# Altium schematic sheet lockdriver(BD682).SchDoc
size A2
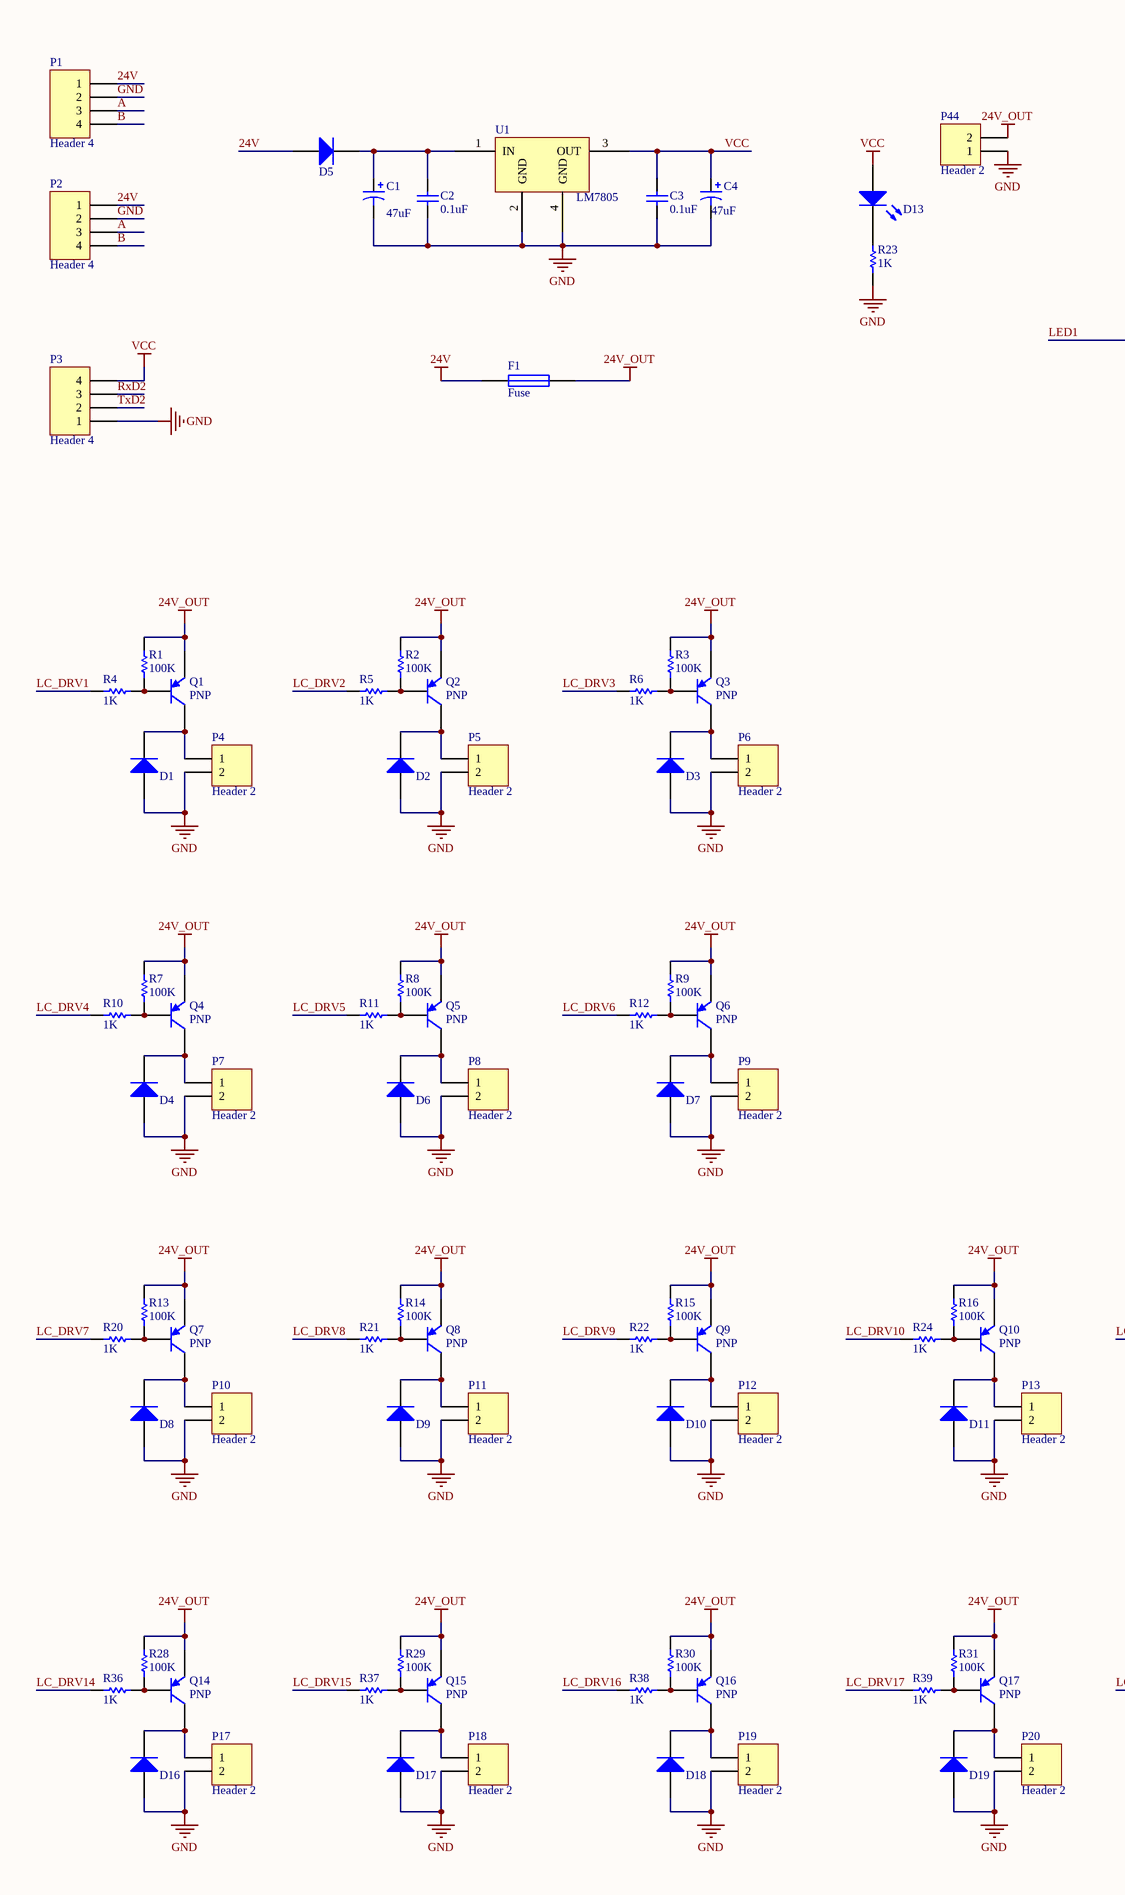
[diagram p0: lockdriver(BD682).SchDoc, left]
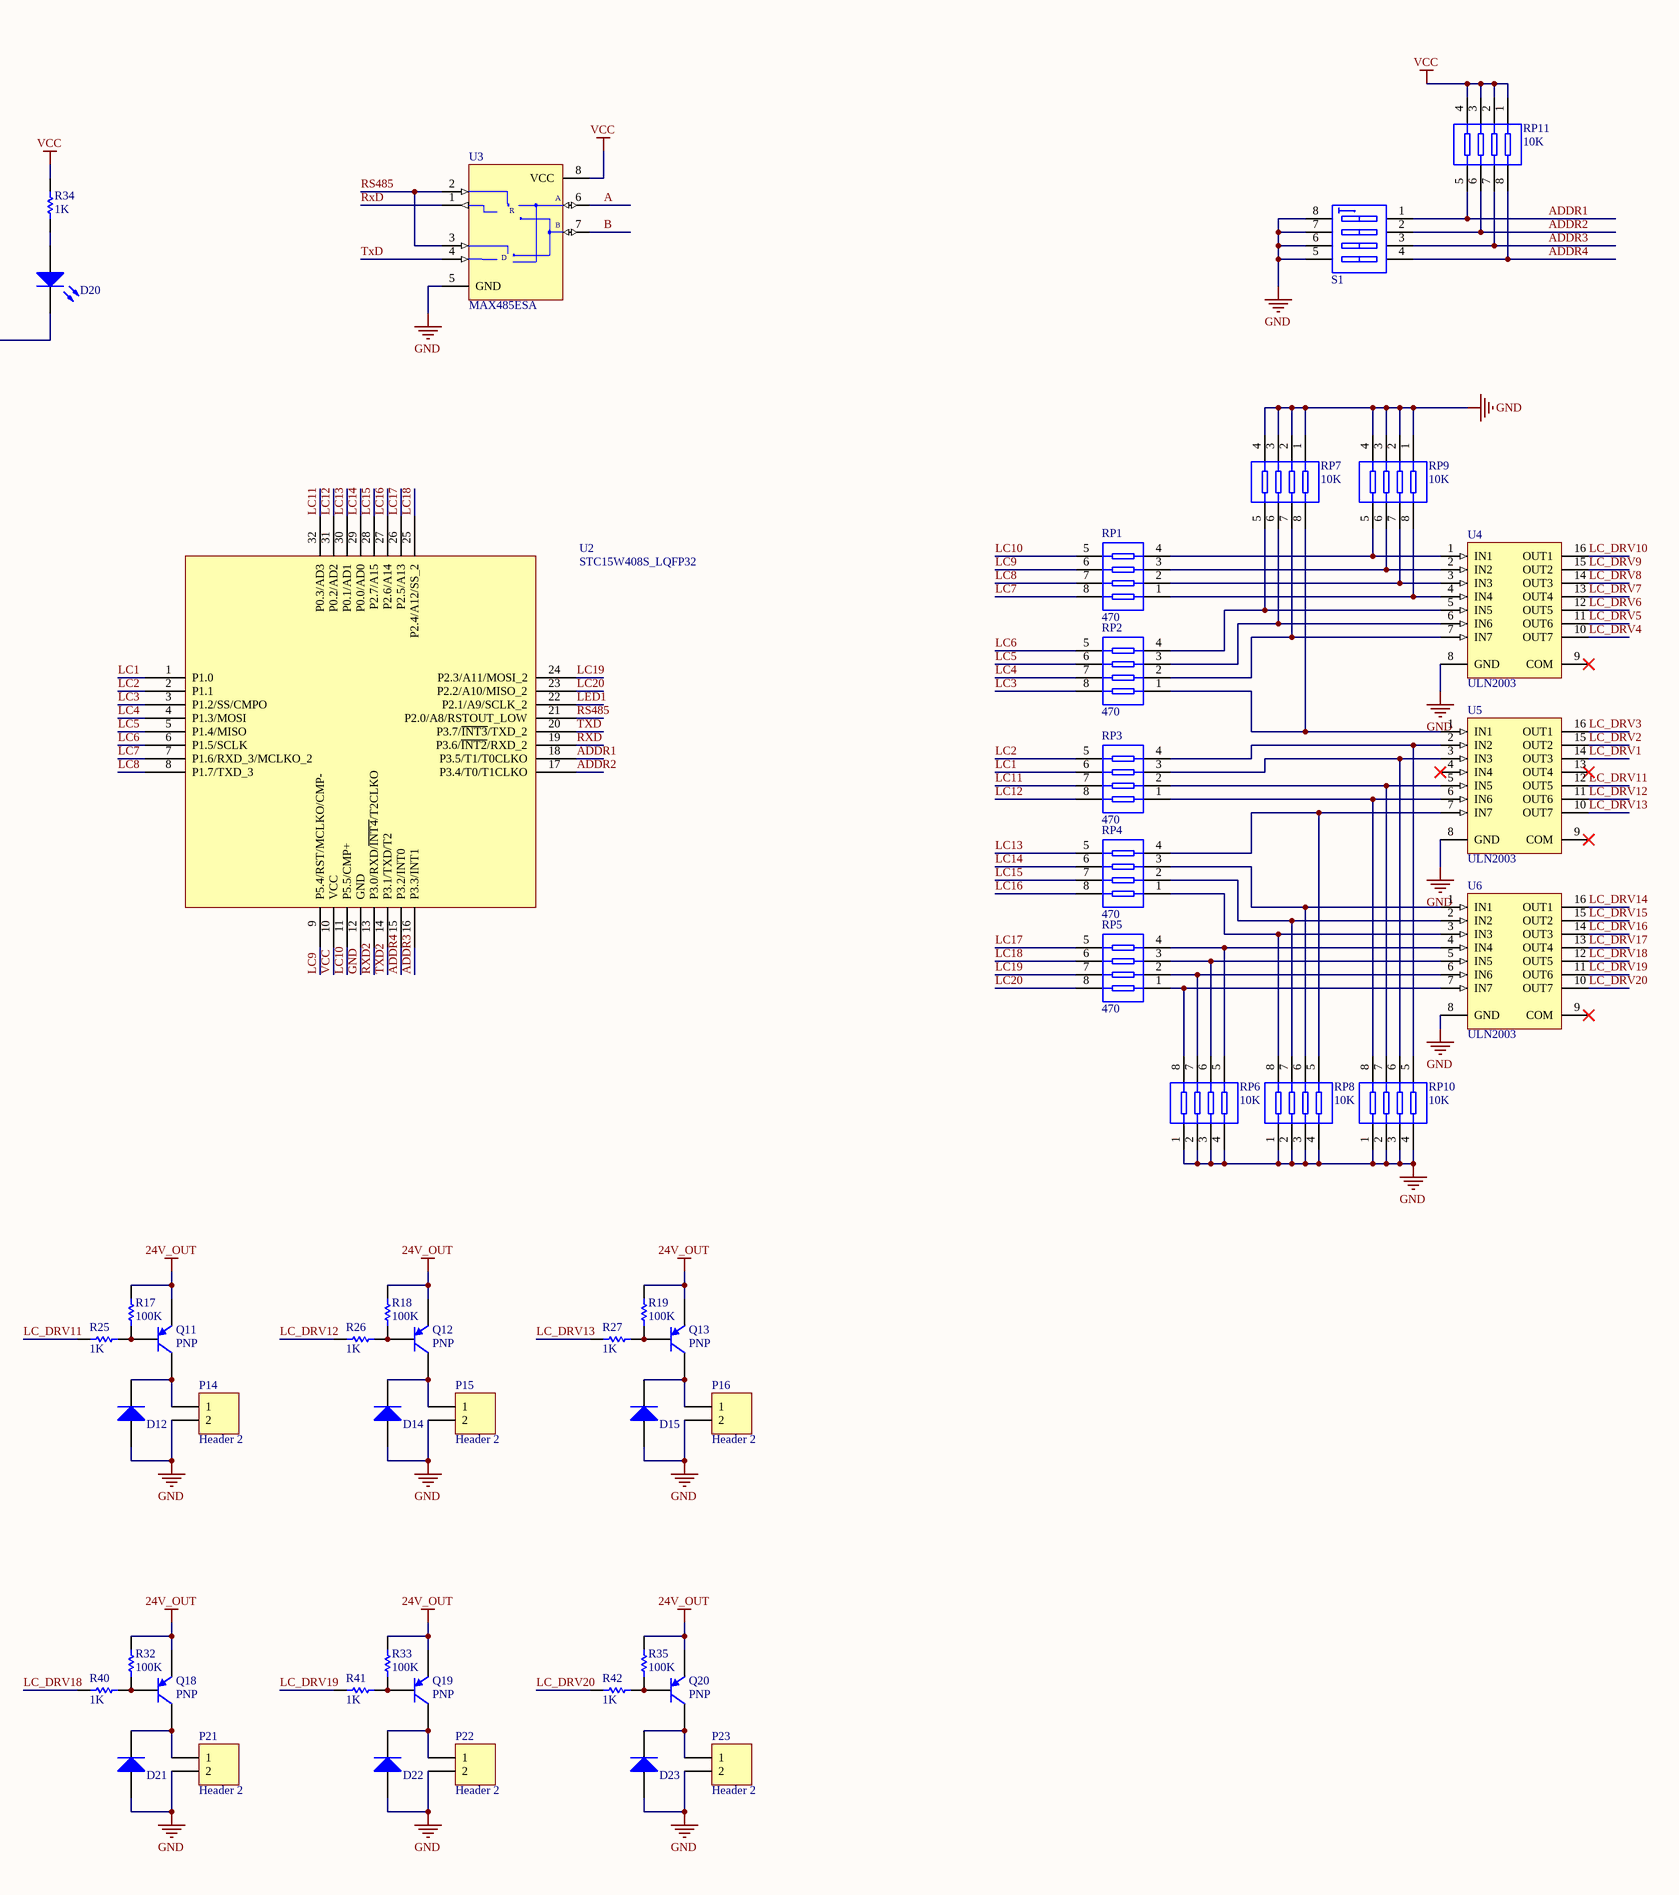
[diagram p1: lockdriver(BD682).SchDoc, right]

## Parts
C1  value 47uF  [CAPPR2-5x11.5]  (hidden comment: Cap Pol2)
C2  0.1uF  [CAPC2012M]
C3  0.1uF  [CAPC2012M]
C4  value 47uF  [CAPPR2-5x11.5]  (hidden comment: Cap Pol2)
D1  1N4007  [DSO-C2/X1.8]  (value not drawn)
D2  1N4007  [DSO-C2/X1.8]  (value not drawn)
D3  1N4007  [DSO-C2/X1.8]  (value not drawn)
D4  1N4007  [DSO-C2/X1.8]  (value not drawn)
D5  1N4007  [DSO-C2/X1.8]  (value not drawn)
D6  1N4007  [DSO-C2/X1.8]  (value not drawn)
D7  1N4007  [DSO-C2/X1.8]  (value not drawn)
D8  1N4007  [DSO-C2/X1.8]  (value not drawn)
D9  1N4007  [DSO-C2/X1.8]  (value not drawn)
D10  1N4007  [DSO-C2/X1.8]  (value not drawn)
D11  1N4007  [DSO-C2/X1.8]  (value not drawn)
D12  1N4007  [DSO-C2/X1.8]  (value not drawn)
D13  LED  [LED2012M]  (value not drawn)
D14  1N4007  [DSO-C2/X1.8]  (value not drawn)
D15  1N4007  [DSO-C2/X1.8]  (value not drawn)
D16  1N4007  [DSO-C2/X1.8]  (value not drawn)
D17  1N4007  [DSO-C2/X1.8]  (value not drawn)
D18  1N4007  [DSO-C2/X1.8]  (value not drawn)
D19  1N4007  [DSO-C2/X1.8]  (value not drawn)
D20  LED  [LED2012M]  (value not drawn)
D21  1N4007  [DSO-C2/X1.8]  (value not drawn)
D22  1N4007  [DSO-C2/X1.8]  (value not drawn)
D23  1N4007  [DSO-C2/X1.8]  (value not drawn)
F1  Fuse  [SR075]
P1  Header 4  [VH396-4]
P2  Header 4  [VH396-4]
P3  Header 4  [HDR1X4]
P4  Header 2  [XH254-2]
P5  Header 2  [XH254-2]
P6  Header 2  [XH254-2]
P7  Header 2  [XH254-2]
P8  Header 2  [XH254-2]
P9  Header 2  [XH254-2]
P10  Header 2  [XH254-2]
P11  Header 2  [XH254-2]
P12  Header 2  [XH254-2]
P13  Header 2  [XH254-2]
P14  Header 2  [XH254-2]
P15  Header 2  [XH254-2]
P16  Header 2  [XH254-2]
P17  Header 2  [XH254-2]
P18  Header 2  [XH254-2]
P19  Header 2  [XH254-2]
P20  Header 2  [XH254-2]
P21  Header 2  [XH254-2]
P22  Header 2  [XH254-2]
P23  Header 2  [XH254-2]
P44  Header 2  [VH396-2]
Q1  PNP  [SOT_32]
Q2  PNP  [SOT_32]
Q3  PNP  [SOT_32]
Q4  PNP  [SOT_32]
Q5  PNP  [SOT_32]
Q6  PNP  [SOT_32]
Q7  PNP  [SOT_32]
Q8  PNP  [SOT_32]
Q9  PNP  [SOT_32]
Q10  PNP  [SOT_32]
Q11  PNP  [SOT_32]
Q12  PNP  [SOT_32]
Q13  PNP  [SOT_32]
Q14  PNP  [SOT_32]
Q15  PNP  [SOT_32]
Q16  PNP  [SOT_32]
Q17  PNP  [SOT_32]
Q18  PNP  [SOT_32]
Q19  PNP  [SOT_32]
Q20  PNP  [SOT_32]
R1  100K  [RESC2012M]
R2  100K  [RESC2012M]
R3  100K  [RESC2012M]
R4  1K  [RESC2012M]
R5  1K  [RESC2012M]
R6  1K  [RESC2012M]
R7  100K  [RESC2012M]
R8  100K  [RESC2012M]
R9  100K  [RESC2012M]
R10  1K  [RESC2012M]
R11  1K  [RESC2012M]
R12  1K  [RESC2012M]
R13  100K  [RESC2012M]
R14  100K  [RESC2012M]
R15  100K  [RESC2012M]
R16  100K  [RESC2012M]
R17  100K  [RESC2012M]
R18  100K  [RESC2012M]
R19  100K  [RESC2012M]
R20  1K  [RESC2012M]
R21  1K  [RESC2012M]
R22  1K  [RESC2012M]
R23  1K  [RESC2012M]
R24  1K  [RESC2012M]
R25  1K  [RESC2012M]
R26  1K  [RESC2012M]
R27  1K  [RESC2012M]
R28  100K  [RESC2012M]
R29  100K  [RESC2012M]
R30  100K  [RESC2012M]
R31  100K  [RESC2012M]
R32  100K  [RESC2012M]
R33  100K  [RESC2012M]
R34  1K  [RESC2012M]
R35  100K  [RESC2012M]
R36  1K  [RESC2012M]
R37  1K  [RESC2012M]
R38  1K  [RESC2012M]
R39  1K  [RESC2012M]
R40  1K  [RESC2012M]
R41  1K  [RESC2012M]
R42  1K  [RESC2012M]
RP1  470  [EXB38V]
RP2  470  [EXB38V]
RP3  470  [EXB38V]
RP4  470  [EXB38V]
RP5  470  [EXB38V]
RP6  10K  [EXB38V]
RP7  10K  [EXB38V]
RP8  10K  [EXB38V]
RP9  10K  [EXB38V]
RP10  10K  [EXB38V]
RP11  10K  [EXB38V]
S1  SW DIP-4  [SWITCH-8]  (value not drawn)
U1  LM7805  [SOT223-4M]
U2  STC15W408S_LQFP32  [LQFP32]
U3  MAX485ESA  [SO8_M]
U4  ULN2003  [SO16_M]
U5  ULN2003  [SO16_M]
U6  ULN2003  [SO16_M]

## Nets
24V: D5.1(A) F1.1 P1.1 P2.1
24V_OUT: F1.2 P44.2 Q1.2(E) Q2.2(E) Q3.2(E) Q4.2(E) Q5.2(E) Q6.2(E) Q7.2(E) Q8.2(E) Q9.2(E) Q10.2(E) Q11.2(E) Q12.2(E) Q13.2(E) Q14.2(E) Q15.2(E) Q16.2(E) Q17.2(E) Q18.2(E) Q19.2(E) Q20.2(E) R1.2 R2.2 R3.2 R7.2 R8.2 R9.2 R13.2 R14.2 R15.2 R16.2 R17.2 R18.2 R19.2 R28.2 R29.2 R30.2 R31.2 R32.2 R33.2 R35.2
GND: C1.2 C2.1 C3.2 C4.2 D1.1(A) D2.1(A) D3.1(A) D4.1(A) D6.1(A) D7.1(A) D8.1(A) D9.1(A) D10.1(A) D11.1(A) D12.1(A) D14.1(A) D15.1(A) D16.1(A) D17.1(A) D18.1(A) D19.1(A) D21.1(A) D22.1(A) D23.1(A) P1.2 P2.2 P3.1 P4.2 P5.2 P6.2 P7.2 P8.2 P9.2 P10.2 P11.2 P12.2 P13.2 P14.2 P15.2 P16.2 P17.2 P18.2 P19.2 P20.2 P21.2 P22.2 P23.2 P44.1 R23.1 RP6.1 RP6.2 RP6.3 RP6.4 RP7.1 RP7.2 RP7.3 RP7.4 RP8.1 RP8.2 RP8.3 RP8.4 RP9.1 RP9.2 RP9.3 RP9.4 RP10.1 RP10.2 RP10.3 RP10.4 S1.5(B4) S1.6(B3) S1.7(B2) S1.8(B1) U1.2(GND) U1.4(GND) U2.12(GND) U3.5(GND) U4.8(GND) U5.8(GND) U6.8(GND)
VCC: C3.1 C4.1 D13.1(A) P3.4 R34.2 RP11.1 RP11.2 RP11.3 RP11.4 U1.3(OUT) U2.10(VCC) U3.8(VCC)
A: P1.3 P2.3 U3.6(A)
ADDR1: RP11.5 S1.1(A1) U2.18(P3.5/T1/T0CLKO)
ADDR2: RP11.6 S1.2(A2) U2.17(P3.4/T0/T1CLKO)
ADDR3: RP11.7 S1.3(A3) U2.16(P3.3/INT1)
ADDR4: RP11.8 S1.4(A4) U2.15(P3.2/INT0)
B: P1.4 P2.4 U3.7(B)
LC1: RP3.6 U2.1(P1.0)
LC2: RP3.5 U2.2(P1.1)
LC3: RP2.8 U2.3(P1.2/SS/CMPO)
LC4: RP2.7 U2.4(P1.3/MOSI)
LC5: RP2.6 U2.5(P1.4/MISO)
LC6: RP2.5 U2.6(P1.5/SCLK)
LC7: RP1.8 U2.7(P1.6/RXD_3/MCLKO_2)
LC8: RP1.7 U2.8(P1.7/TXD_3)
LC9: RP1.6 U2.9(P5.4/RST/MCLKO/CMP-)
LC10: RP1.5 U2.11(P5.5/CMP+)
LC11: RP3.7 U2.32(P0.3/AD3)
LC12: RP3.8 U2.31(P0.2/AD2)
LC13: RP4.5 U2.30(P0.1/AD1)
LC14: RP4.6 U2.29(P0.0/AD0)
LC15: RP4.7 U2.28(P2.7/A15)
LC16: RP4.8 U2.27(P2.6/A14)
LC17: RP5.5 U2.26(P2.5/A13)
LC18: RP5.6 U2.25(P2.4/A12/SS_2)
LC19: RP5.7 U2.24(P2.3/A11/MOSI_2)
LC20: RP5.8 U2.23(P2.2/A10/MISO_2)
LC_DRV1: R4.2 U5.14(OUT3)
LC_DRV2: R5.2 U5.15(OUT2)
LC_DRV3: R6.2 U5.16(OUT1)
LC_DRV4: R10.2 U4.10(OUT7)
LC_DRV5: R11.2 U4.11(OUT6)
LC_DRV6: R12.2 U4.12(OUT5)
LC_DRV7: R20.2 U4.13(OUT4)
LC_DRV8: R21.2 U4.14(OUT3)
LC_DRV9: R22.2 U4.15(OUT2)
LC_DRV10: R24.2 U4.16(OUT1)
LC_DRV11: R25.2 U5.12(OUT5)
LC_DRV12: R26.2 U5.11(OUT6)
LC_DRV13: R27.2 U5.10(OUT7)
LC_DRV14: R36.2 U6.16(OUT1)
LC_DRV15: R37.2 U6.15(OUT2)
LC_DRV16: R38.2 U6.14(OUT3)
LC_DRV17: R39.2 U6.13(OUT4)
LC_DRV18: R40.2 U6.12(OUT5)
LC_DRV19: R41.2 U6.11(OUT6)
LC_DRV20: R42.2 U6.10(OUT7)
LED1: D20.2(K) U2.22(P2.1/A9/SCLK_2)
RS485: U2.21(P2.0/A8/RSTOUT_LOW) U3.2(~{RE}) U3.3(DE)
RxD: U2.19(P3.6/~{INT2}/RXD_2) U3.1(RO)
RxD2: P3.3 U2.13(P3.0/RXD/~{INT4}/T2CLKO)
TxD: U2.20(P3.7/~{INT3}/TXD_2) U3.4(DI)
TxD2: P3.2 U2.14(P3.1/TXD/T2)
NetC1_1: C1.1 C2.2 D5.2(K) U1.1(IN)
NetD1_2: D1.2(K) P4.1 Q1.3(C)
NetD2_2: D2.2(K) P5.1 Q2.3(C)
NetD3_2: D3.2(K) P6.1 Q3.3(C)
NetD4_2: D4.2(K) P7.1 Q4.3(C)
NetD6_2: D6.2(K) P8.1 Q5.3(C)
NetD7_2: D7.2(K) P9.1 Q6.3(C)
NetD8_2: D8.2(K) P10.1 Q7.3(C)
NetD9_2: D9.2(K) P11.1 Q8.3(C)
NetD10_2: D10.2(K) P12.1 Q9.3(C)
NetD11_2: D11.2(K) P13.1 Q10.3(C)
NetD12_2: D12.2(K) P14.1 Q11.3(C)
NetD13_2: D13.2(K) R23.2
NetD14_2: D14.2(K) P15.1 Q12.3(C)
NetD15_2: D15.2(K) P16.1 Q13.3(C)
NetD16_2: D16.2(K) P17.1 Q14.3(C)
NetD17_2: D17.2(K) P18.1 Q15.3(C)
NetD18_2: D18.2(K) P19.1 Q16.3(C)
NetD19_2: D19.2(K) P20.1 Q17.3(C)
NetD20_1: D20.1(A) R34.1
NetD21_2: D21.2(K) P21.1 Q18.3(C)
NetD22_2: D22.2(K) P22.1 Q19.3(C)
NetD23_2: D23.2(K) P23.1 Q20.3(C)
NetQ1_1: Q1.1(B) R1.1 R4.1
NetQ2_1: Q2.1(B) R2.1 R5.1
NetQ3_1: Q3.1(B) R3.1 R6.1
NetQ4_1: Q4.1(B) R7.1 R10.1
NetQ5_1: Q5.1(B) R8.1 R11.1
NetQ6_1: Q6.1(B) R9.1 R12.1
NetQ7_1: Q7.1(B) R13.1 R20.1
NetQ8_1: Q8.1(B) R14.1 R21.1
NetQ9_1: Q9.1(B) R15.1 R22.1
NetQ10_1: Q10.1(B) R16.1 R24.1
NetQ11_1: Q11.1(B) R17.1 R25.1
NetQ12_1: Q12.1(B) R18.1 R26.1
NetQ13_1: Q13.1(B) R19.1 R27.1
NetQ14_1: Q14.1(B) R28.1 R36.1
NetQ15_1: Q15.1(B) R29.1 R37.1
NetQ16_1: Q16.1(B) R30.1 R38.1
NetQ17_1: Q17.1(B) R31.1 R39.1
NetQ18_1: Q18.1(B) R32.1 R40.1
NetQ19_1: Q19.1(B) R33.1 R41.1
NetQ20_1: Q20.1(B) R35.1 R42.1
NetRP1_1: RP1.1 RP9.8 U4.4(IN4)
NetRP1_2: RP1.2 RP9.7 U4.3(IN3)
NetRP1_3: RP1.3 RP9.6 U4.2(IN2)
NetRP1_4: RP1.4 RP9.5 U4.1(IN1)
NetRP2_1: RP2.1 RP7.8 U5.1(IN1)
NetRP2_2: RP2.2 RP7.7 U4.7(IN7)
NetRP2_3: RP2.3 RP7.6 U4.6(IN6)
NetRP2_4: RP2.4 RP7.5 U4.5(IN5)
NetRP3_1: RP3.1 RP10.8 U5.6(IN6)
NetRP3_2: RP3.2 RP10.7 U5.5(IN5)
NetRP3_3: RP3.3 RP10.6 U5.3(IN3)
NetRP3_4: RP3.4 RP10.5 U5.2(IN2)
NetRP4_1: RP4.1 RP8.8 U6.3(IN3)
NetRP4_2: RP4.2 RP8.7 U6.2(IN2)
NetRP4_3: RP4.3 RP8.6 U6.1(IN1)
NetRP4_4: RP4.4 RP8.5 U5.7(IN7)
NetRP5_1: RP5.1 RP6.8 U6.7(IN7)
NetRP5_2: RP5.2 RP6.7 U6.6(IN6)
NetRP5_3: RP5.3 RP6.6 U6.5(IN5)
NetRP5_4: RP5.4 RP6.5 U6.4(IN4)

Not connected (* = marked no-connect by the designer): U4 9(COM)*; U5 4(IN4)* 9(COM)* 13(OUT4)*; U6 9(COM)*

## Notes on the sheet
- (in symbol MAX485ESA) R; D

## Library data of the parts
C1 C4 = Cap Pol2: Polarized Capacitor (22uf-47uf); Published: 8-Jun-2000; LatestRevisionDate: 17-Jul-2002; LatestRevisionNote: Re-released for DXP Platform.; Publisher: Altium Limited; PackageDescription: Polarized Capacitor; 2 Leads
C2 C3 = Cap: Capacitor; Published: 8-Jun-2000; LatestRevisionDate: 17-Jul-2002; LatestRevisionNote: Re-released for DXP Platform.; PackageReference: RAD-0.3; Publisher: Altium Limited; PackageDescription: Radial Cap, Thru-Hole; 2 Leads; 0.3 in Pin Spacing; Value: 0.1uF
D1-D12 D14-D19 D21-D23 = Diode: Default Diode; Published: 8-Jun-2000; LatestRevisionDate: 17-Jul-2002; LatestRevisionNote: Re-released for DXP Platform.; PackageVersion: Sep-1996; PackageReference: SMC; Publisher: Altium Limited; PackageDescription: DO-214-AB/SMC; 2 C-Bend Leads; Body 7.9 x 5.9 mm, inc. leads (LxW); Code_JEDEC: DO-214-AB; Value: 1N4007
D13 D20 = LED: Typical INFRARED GaAs LED; Published: 8-Jun-2000; LatestRevisionDate: 08-Jul-2005; LatestRevisionNote: Mech Layer 1 removed.; PackageReference: LED-0; Publisher: Altium Limited; PackageDescription: LED; 2 Leads
P1-P3 = Header 4: Header, 4-Pin; LatestRevisionDate: 17-Jul-2002; LatestRevisionNote: Re-released for DXP Platform.; Publisher: Altium Limited
P4-P23 P44 = Header 2: Header, 2-Pin; LatestRevisionDate: 17-Jul-2002; LatestRevisionNote: Re-released for DXP Platform.; Publisher: Altium Limited
Q1-Q20 = PNP: PNP Bipolar Transistor; Published: 8-Jun-2000; LatestRevisionDate: 29-May-2009; LatestRevisionNote: IPC-7351 Footprint Added.; PackageVersion: Aug-1999; PackageReference: SOT-23B; Publisher: Altium Limited; PackageDescription: 3-Pin SOT-23 Package 0.95 mm Pitch, 2.4 mm Lead Span
R1-R42 = Res: Resistor; Published: 8-Jun-2000; LatestRevisionDate: 17-Jul-2002; LatestRevisionNote: Re-released for DXP Platform.; PackageReference: AXIAL-0.3; Publisher: Altium Limited; PackageDescription: Axial Device, Thru-Hole; 2 Leads; 0.3 in Pin Spacing
  R1-R3 R7-R9 R13-R19 R28-R33 R35: Value: 100K
  R4-R6 R10-R12 R20-R27 R34 R36-R42: Value: 1K
RP1-RP11 = Res Pack
  RP1-RP5: Value: 470
  RP6-RP11: Value: 10K
S1 = SW DIP-4: DIP Switch, 4 Position, SPST; Published: 24-Mar-1999; LatestRevisionDate: 29-May-2009; LatestRevisionNote: IPC-7351 Footprint Added.; PackageVersion: Dec-2002; PackageReference: SO8; Publisher: Altium Limited; PackageDescription: 8-Pin Small Outline Integrated Circuit 1.27 mm Pitch; Code_JEDEC: MS-012-AA; Code_IPC: SOIC127P600-8
U3 = MAX485ESA: Low-Power, Slew-Rate-Limited RS-485/RS-422 Transceiver; Published: 16-Jan-2001; LatestRevisionDate: 13-Apr-2006; LatestRevisionNote: IPC-7351 Footprint Added.; DatasheetVersion: Feb-1996; PackageReference: NSO8; Publisher: Altium Limited; PackageDescription: 8-Pin Small Outline Integrated Circuit 1.27 mm Pitch; Code_JEDEC: MS-012-AA; Code_IPC: SOIC127P600-8; ComponentLink1Description: Manufacturer Link; ComponentLink1URL: http://www.maxim-ic.com/; ComponentLink2Description: Datasheet; ComponentLink2URL: http://pdfserv.maxim-ic.com/en/ds/MAX1487-MAX491.pdf
U4-U6 = ULN2003: Seven Darlington Array; Published: 8-Jun-2000; LatestRevisionDate: 13-Apr-2006; LatestRevisionNote: IPC-7351 Footprint Added.; DatasheetVersion: Sep-1998; PackageVersion: May-1998; PackageReference: SO16; Publisher: Altium Limited; PackageDescription: 16-Pin Small Outline Integrated Circuit 1.27 mm Pitch; Code_IPC: SOIC127P600-16; ComponentLink1Description: Manufacturer Link; ComponentLink1URL: http://www.st.com/; ComponentLink2Description: Datasheet; ComponentLink2URL: http://www.st.com/stonline/products/literature/ds/5279/uln2001.pdf
F1 = Fuse: Published: 8-Jun-2000; LatestRevisionDate: 17-Jul-2002; LatestRevisionNote: Re-released for DXP Platform.; PackageReference: PIN-W2/E2.8; Publisher: Altium Limited; PackageDescription: Thru-Hole; 2 Leads